# Altium project Homodyne_detector.PrjPcb
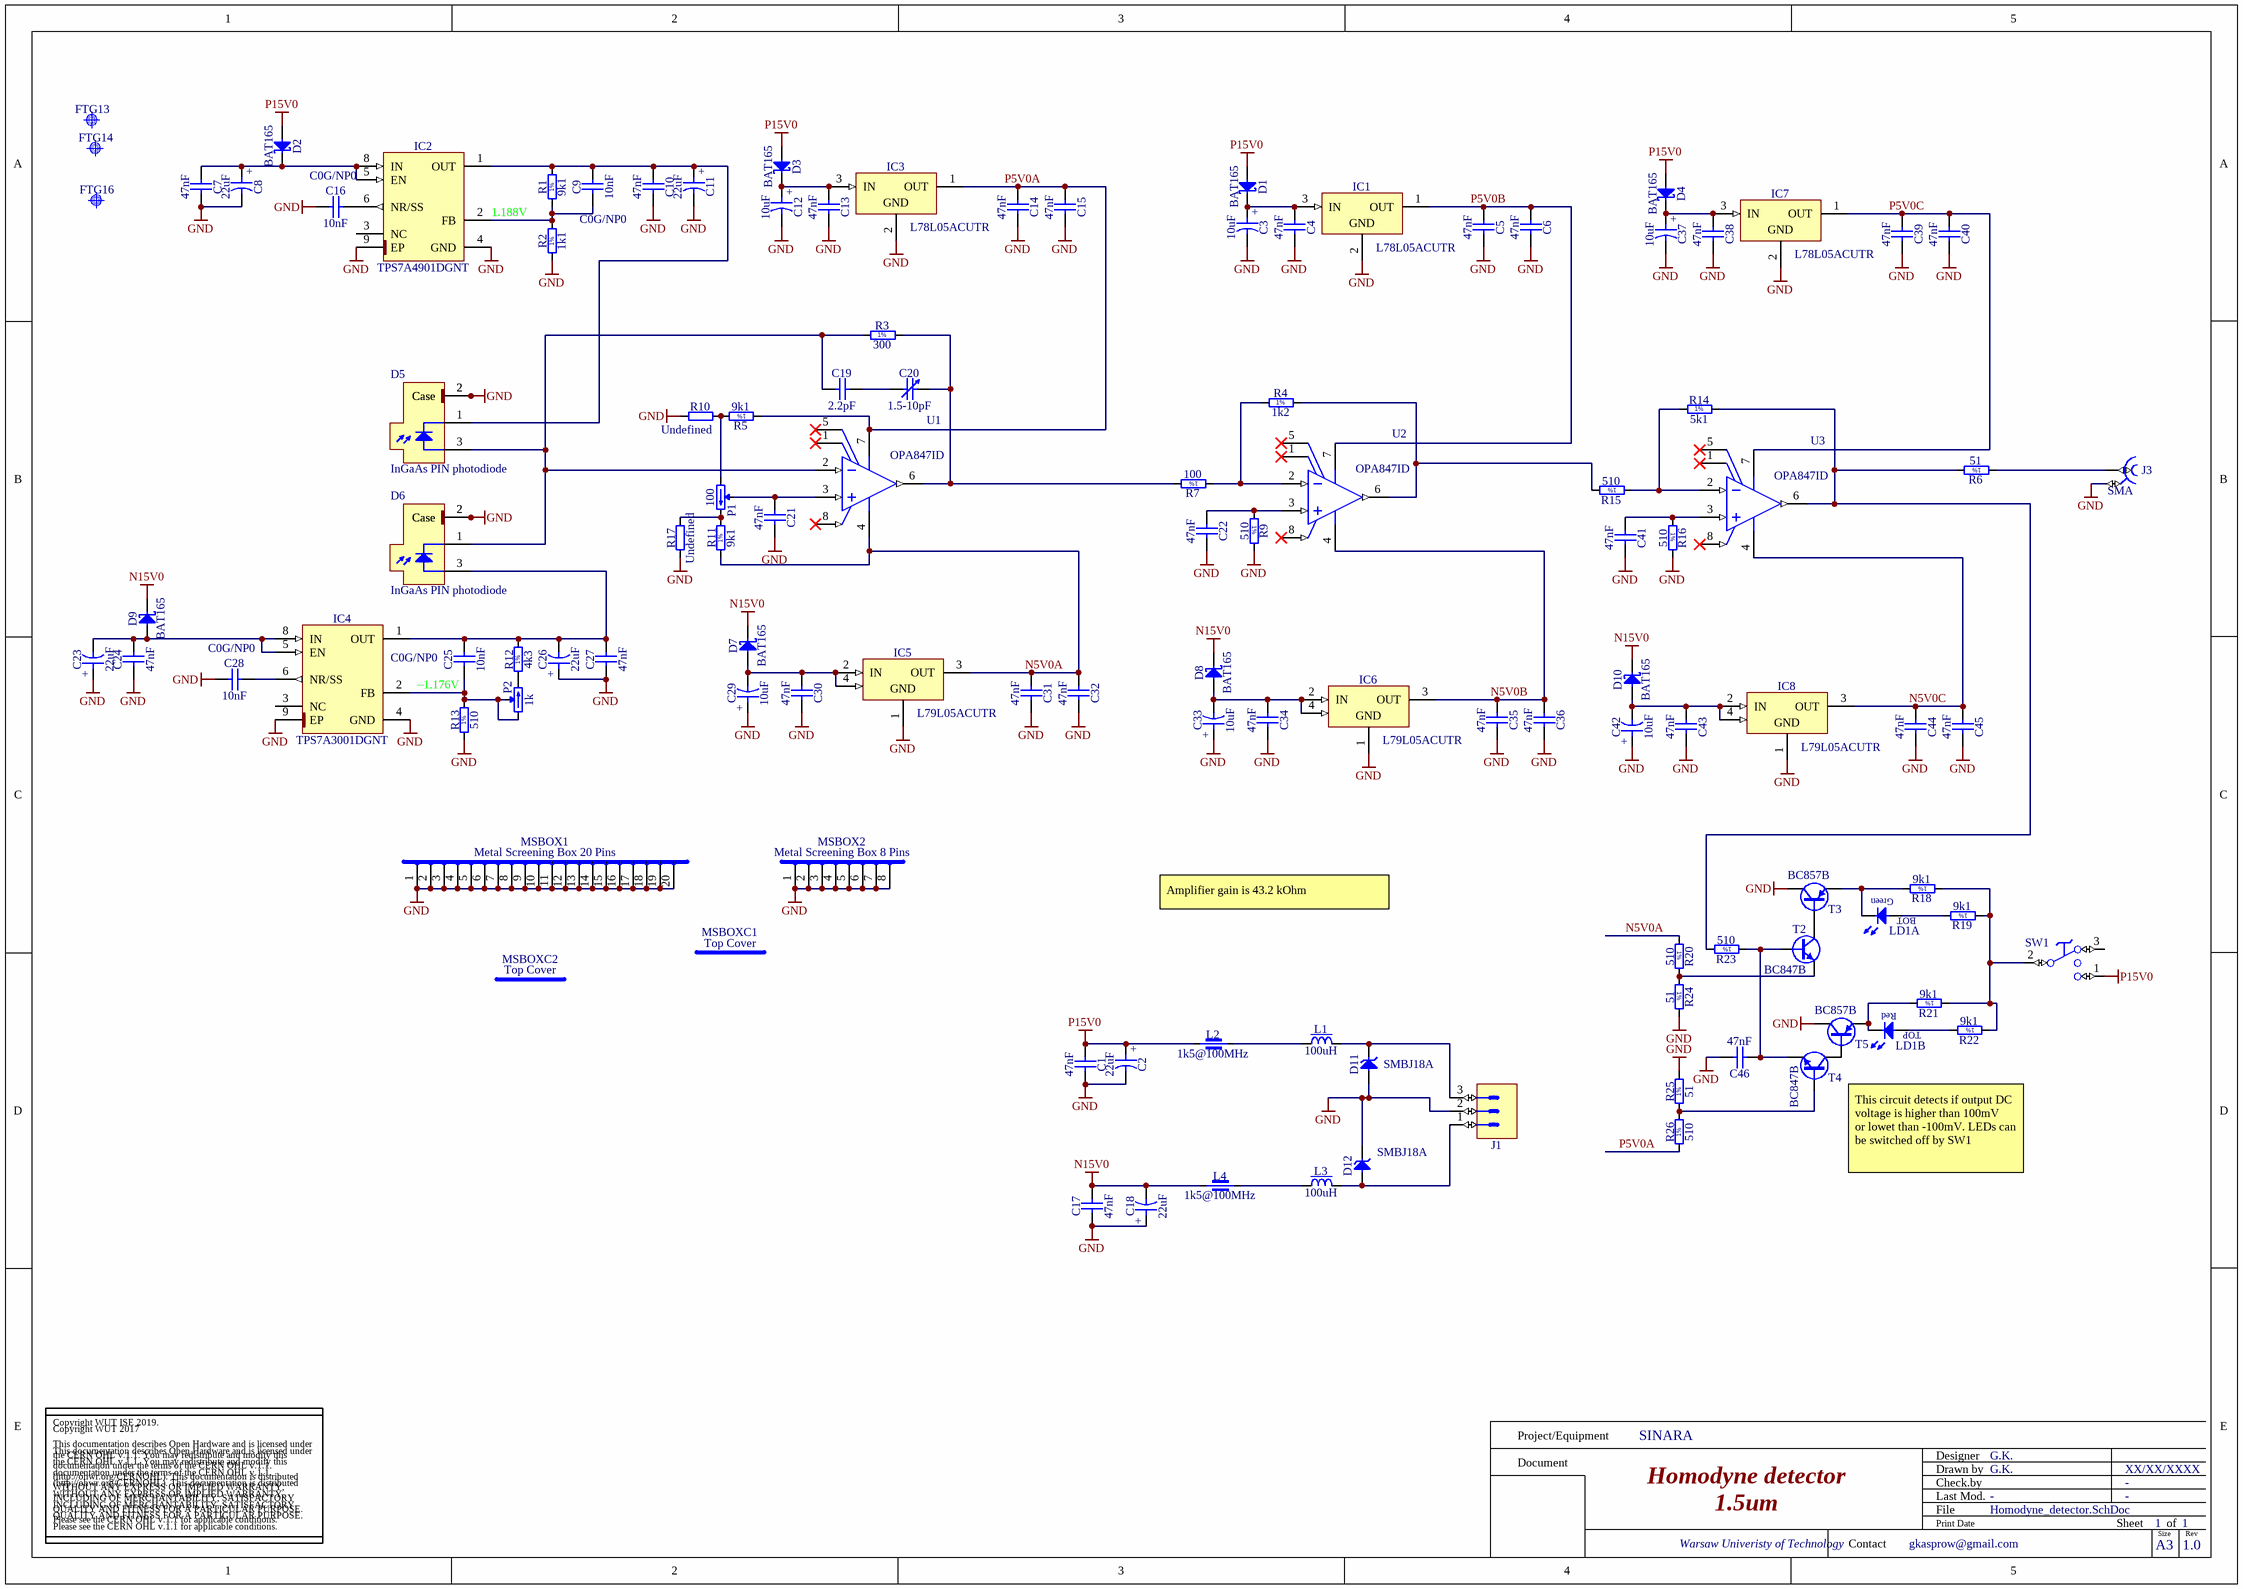
[diagram p0: Homodyne_detector.SchDoc]
1 sheet, 115 parts. Net scope: global (net labels, ports and power ports of the same name join across sheets).
Board file: Homodyne_detector.PcbDoc

## Sheet Homodyne_detector.SchDoc: Homodyne detector
size 420 x 297 mm; Author: G.K.; CompanyName: WUT; DrawnBy: G.K.; Organization: CERN; Address1: Warsaw Univeristy of Technology; Address2: Nowowiejska 15/19; Address3: gkasprow@gmail.com; Revision: 1.0; SheetNumber: 1; SheetTotal: 1; EDA_Number: ARTIQ; Projet: SINARA; ModifiedBy: -; CreateDate: XX/XX/XXXX; CheckedDate: -; Title2: 1.5um; DivGrp: ISE; Designer: G.K.; ModifiedDate: -; ProjectName: SINARA

### Parts
C1  47nF  [CAPC2012X135N]
C2  22uF  [CAPMP7343X190N]
C3  10uF  [CAPAE430X540N]
C4  47nF  [CAPC2012X135N]
C5  47nF  [CAPC2012X135N]
C6  47nF  [CAPC2012X135N]
C7  47nF  [CAPC2012X135N]
C8  22uF  [CAPMP7343X190N]
C9  10nF  TC: C0G/NP0  [CAPC2012X135N]
C10  47nF  [CAPC2012X135N]
C11  22uF  [CAPMP7343X190N]
C12  10uF  [CAPAE430X540N]
C13  47nF  [CAPC2012X135N]
C14  47nF  [CAPC2012X135N]
C15  47nF  [CAPC2012X135N]
C16  10nF  TC: C0G/NP0  [CAPC2012X135N]
C17  47nF  [CAPC2012X135N]
C18  22uF  [CAPMP7343X190N]
C19  2.2pF  [CAPC1608X87N]
C20  1.5-10pF  [CAPV_JOHANSON_9343]
C21  47nF  [CAPC2012X135N]
C22  47nF  [CAPC2012X135N]
C23  22uF  [CAPMP7343X190N]
C24  47nF  [CAPC2012X135N]
C25  10nF  TC: C0G/NP0  [CAPC2012X135N]
C26  22uF  [CAPMP7343X190N]
C27  47nF  [CAPC2012X135N]
C28  10nF  TC: C0G/NP0  [CAPC2012X135N]
C29  10uF  [CAPAE430X540N]
C30  47nF  [CAPC2012X135N]
C31  47nF  [CAPC2012X135N]
C32  47nF  [CAPC2012X135N]
C33  10uF  [CAPAE430X540N]
C34  47nF  [CAPC2012X135N]
C35  47nF  [CAPC2012X135N]
C36  47nF  [CAPC2012X135N]
C37  10uF  [CAPAE430X540N]
C38  47nF  [CAPC2012X135N]
C39  47nF  [CAPC2012X135N]
C40  47nF  [CAPC2012X135N]
C41  47nF  [CAPC2012X135N]
C42  10uF  [CAPAE430X540N]
C43  47nF  [CAPC2012X135N]
C44  47nF  [CAPC2012X135N]
C45  47nF  [CAPC2012X135N]
C46  47nF  [CAPC2012X135N]
D1  BAT165  [SOD2512X110N]
D2  BAT165  [SOD2512X110N]
D3  BAT165  [SOD2512X110N]
D4  BAT165  [SOD2512X110N]
D5  InGaAs PIN photodiode  [Hamamatsu_TO-18_H]
D6  InGaAs PIN photodiode  [Hamamatsu_TO-18_H]
D7  BAT165  [SOD2512X110N]
D8  BAT165  [SOD2512X110N]
D9  BAT165  [SOD2512X110N]
D10  BAT165  [SOD2512X110N]
D11  SMBJ18A  [DIOM5336X265N]
D12  SMBJ18A  [DIOM5336X265N]
FTG13  Use only in PCB  [FIDUCIAL_TOP_C100-200]  (value not drawn)
FTG14  Use only in PCB  [FIDUCIAL_TOP_S100-200]  (value not drawn)
FTG16  Use only in PCB  [FIDUCIAL_TOP_S100-200]  (value not drawn)
IC1  L78L05ACUTR  [SOT89]
IC2  TPS7A4901DGNT  [SOP65P490X110-9N-R157X189]
IC3  L78L05ACUTR  [SOT89]
IC4  TPS7A3001DGNT  [SOP65P490X110-9N-R157X189]
IC5  L79L05ACUTR  [SOT89]
IC6  L79L05ACUTR  [SOT89]
IC7  L78L05ACUTR  [SOT89]
IC8  L79L05ACUTR  [SOT89]
J1  (no value)  [PHOENIX_1757255]
J3  SMA  [RF249BT0050GHDW]
L1  100uH  [INDM5650X530N]
L2  1k5@100MHz  [INDC2012X110N]
L3  100uH  [INDM5650X530N]
L4  1k5@100MHz  [INDC2012X110N]
LD1  Red/Green  [LED_DIALIGHT_571-0112F]  (value not drawn)  (parts A,B of 2)
MSBOX1  Metal Screening Box 20 Pins  [MSBOX_LAIRD_BMI-S-205-F]
MSBOX2  Metal Screening Box 8 Pins  [MSBOX_LAIRD_BMI-S-202-F]
MSBOXC1  Top Cover  [MSBOX_LAIRD_BMI-S-202-C]
MSBOXC2  Top Cover  [MSBOX_LAIRD_BMI-S-205-C]
P1  100  [TRIM_BOURNS_3006P]
P2  1k  [TRIM_BOURNS_3314G-1]
R1  9k1  [RESC1608X55N]
R2  1k1  [RESC1608X55N]
R3  300  [RESC1608X55N]
R4  1k2  [RESC1608X55N]
R5  9k1  [RESC1608X55N]
R6  51  [RESC1608X55N]
R7  100  [RESC1608X55N]
R9  510  [RESC1608X55N]
R10  Undefined  [RESC1608X55N]
R11  9k1  [RESC1608X55N]
R12  4k3  [RESC1608X55N]
R13  510  [RESC1608X55N]
R14  5k1  [RESC1608X55N]
R15  510  [RESC1608X55N]
R16  510  [RESC1608X55N]
R17  Undefined  [RESC1608X55N]
R18  9k1  [RESC1608X55N]
R19  9k1  [RESC1608X55N]
R20  510  [RESC1608X55N]
R21  9k1  [RESC1608X55N]
R22  9k1  [RESC1608X55N]
R23  510  [RESC1608X55N]
R24  51  [RESC1608X55N]
R25  51  [RESC1608X55N]
R26  510  [RESC1608X55N]
SW1  Switch  [SW_NKK_A13AV]  (value not drawn)
T2  BC847B  [SOT95P230X110-3N]
T3  BC857B  [SOT95P230X110-3N]
T4  BC847B  [SOT95P230X110-3N]
T5  BC857B  [SOT95P230X110-3N]
U1  OPA847ID  [D0008A_L]
U2  OPA847ID  [D0008A_L]
U3  OPA847ID  [D0008A_L]

### Nets
GND: C1.2 C2.2 C3.2 C4.2 C5.2 C6.2 C7.2 C8.2 C10.2 C11.2 C12.2 C13.2 C14.2 C15.2 C16.1 C17.1 C18.1 C21.2 C22.2 C23.1 C24.1 C26.1 C27.1 C28.1 C29.1 C30.2 C31.2 C32.2 C33.1 C34.2 C35.2 C36.2 C37.2 C38.2 C39.2 C40.2 C41.2 C42.1 C43.2 C44.2 C45.2 C46.2 D5.2(Case) D6.2(Case) D11.2(A) D12.1(C) IC1.2(GND) IC2.4(GND) IC2.9(EP) IC3.2(GND) IC4.4(GND) IC4.9(EP) IC5.1(GND) IC6.1(GND) IC7.2(GND) IC8.1(GND) J1.2 J3.2 MSBOX1.1 MSBOX1.2 MSBOX1.3 MSBOX1.4 MSBOX1.5 MSBOX1.6 MSBOX1.7 MSBOX1.8 MSBOX1.9 MSBOX1.10 MSBOX1.11 MSBOX1.12 MSBOX1.13 MSBOX1.14 MSBOX1.15 MSBOX1.16 MSBOX1.17 MSBOX1.18 MSBOX1.19 MSBOX1.20 MSBOX2.1 MSBOX2.2 MSBOX2.3 MSBOX2.4 MSBOX2.5 MSBOX2.6 MSBOX2.7 MSBOX2.8 R2.1 R9.2 R10.1 R13.1 R16.2 R17.1 R24.2 R25.2 T3.3(C) T5.3(C)
N15V0: C17.2 C18.2 D7.1(C) D8.1(C) D9.1(C) D10.1(C) L4.1
P15V0: C1.1 C2.1 D1.2(A) D2.2(A) D3.2(A) D4.2(A) L2.1 SW1.1(NO)
N5V0A: C31.1 C32.1 IC5.3(OUT) R11.1 R20.1 U1.4(VS-)
N5V0B: C35.1 C36.1 IC6.3(OUT) U2.4(VS-)
N5V0C: C44.1 C45.1 IC8.3(OUT) U3.4(VS-)
P5V0A: C14.1 C15.1 IC3.1(OUT) R5.1 R26.1 U1.7(VS+)
P5V0B: C5.1 C6.1 IC1.1(OUT) U2.7(VS+)
P5V0C: C39.1 C40.1 IC7.1(OUT) U3.7(VS+)
NetC3_1: C3.1 C4.1 D1.1(C) IC1.3(IN)
NetC7_1: C7.1 C8.1 D2.1(C) IC2.5(EN) IC2.8(IN)
NetC9_1: C9.1 IC2.2(FB) R1.1 R2.2
NetC9_2: C9.2 C10.1 C11.1 D5.1(Cathode) IC2.1(OUT) R1.2
NetC12_1: C12.1 C13.1 D3.1(C) IC3.3(IN)
NetC16_2: C16.2 IC2.6(NR/SS)
NetC19_1: C19.1 D5.3(Anode) D6.1(Cathode) R3.1 U1.2(IN-)
NetC19_2: C19.2 C20.1
NetC20_2: C20.2 R3.2 R7.2 U1.6(OUT)
NetC21_1: C21.1 P1.2(W) U1.3(IN+)
NetC22_1: C22.1 R9.1 U2.3(IN+)
NetC23_2: C23.2 C24.2 D9.2(A) IC4.5(EN) IC4.8(IN)
NetC25_1: C25.1 IC4.2(FB) P2.1(CCW) P2.2(W) R13.2
NetC25_2: C25.2 C26.2 C27.2 D6.3(Anode) IC4.1(OUT) R12.2
NetC28_2: C28.2 IC4.6(NR/SS)
NetC29_2: C29.2 C30.1 D7.2(A) IC5.2(IN) IC5.4(IN)
NetC33_2: C33.2 C34.1 D8.2(A) IC6.2(IN) IC6.4(IN)
NetC37_1: C37.1 C38.1 D4.1(C) IC7.3(IN)
NetC41_1: C41.1 R16.1 U3.3(IN+)
NetC42_2: C42.2 C43.1 D10.2(A) IC8.2(IN) IC8.4(IN)
NetC46_1: C46.1 R23.1 T2.1(B) T4.2(E)
NetD11_1: D11.1(C) J1.3 L1.2
NetD12_2: D12.2(A) J1.1 L3.2
NetJ3_1: J3.1 R6.1
NetL1_1: L1.1 L2.2
NetL3_1: L3.1 L4.2
NetLD1_1: LD1.1(C) R18.2 T3.2(E)
NetLD1_2: LD1.2(A) R19.2
NetLD1_3: LD1.3(C) R21.2 T5.2(E)
NetLD1_4: LD1.4(A) R22.2
NetP1_1: P1.1(CCW) R5.2 R10.2
NetP1_3: P1.3(CW) R11.2 R17.2
NetP2_3: P2.3(CW) R12.1
NetR4_1: R4.1 R7.1 U2.2(IN-)
NetR4_2: R4.2 R15.2 U2.6(OUT)
NetR6_2: R6.2 R14.2 R23.2 U3.6(OUT)
NetR14_1: R14.1 R15.1 U3.2(IN-)
NetR18_1: R18.1 R19.1 R21.1 R22.1 SW1.2(C)
NetR20_2: R20.2 R24.1 T2.2(E)
NetR25_1: R25.1 R26.2 T4.1(B)
NetT2_3: T2.3(C) T3.1(B)
NetT4_3: T4.3(C) T5.1(B)

Not connected (* = marked no-connect by the designer): IC2 3(NC); IC4 3(NC); SW1 3(NC); U1 1(NC)* 5(NC)* 8(~{DIS})*; U2 1(NC)* 5(NC)* 8(~{DIS})*; U3 1(NC)* 5(NC)* 8(~{DIS})*

### Notes on the sheet
- 1.188V
- –1.176V
- Amplifier gain is 43.2 kOhm
- This circuit detects if output DC voltage is higher than 100mV
  or lowet than -100mV. LEDs can be switched off by SW1
- Copyright WUT 2017
  This documentation describes Open Hardware and is licensed under the CERN OHL v.1.1. You may redistribute and modify this documentation under the terms of the CERN OHL v.1.1. (http://ohwr.org/CERNOHL). This documentation is distributed WITHOUT ANY EXPRESS OR IMPLIED WARRANTY, INCLUDING OF MERCHANTABILITY, SATISFACTORY QUALITY AND FITNESS FOR A PARTICULAR PURPOSE. Please see the CERN OHL v.1.1 for applicable conditions.
- Project/Equipment
- Document
- Designer
- Drawn by
- Check.by
- Copyright WUT ISE 2019.
  This documentation describes Open Hardware and is licensed under the CERN OHL v.1.1. You may redistribute and modify this documentation under the terms of the CERN OHL v.1.1. (http://ohwr.org/CERNOHL). This documentation is distributed WITHOUT ANY EXPRESS OR IMPLIED WARRANTY, INCLUDING OF MERCHANTABILITY, SATISFACTORY QUALITY AND FITNESS FOR A PARTICULAR PURPOSE. Please see the CERN OHL v.1.1 for applicable conditions.
- Contact
- File
- Last Mod.
- Print Date
- Sheet
- Size
- A3
- of
- Rev
- (in symbol CAE430-540_10UF_25V_20%) +
- (in symbol CTE7343-19_22UF_20V_20%_LESR0045_KEMET_T520) +
- (in symbol LED_DIALIGHT_571-0112F, part A) Green; BOT
- (in symbol LED_DIALIGHT_571-0112F, part B) Red; TOP
- (in symbol R0603_1K1_1%_0.1W_100PPM) 1%
- (in symbol R0603_1k2_1%_0.1W_100PPM) 1%
- (in symbol R0603_4K3_1%_0.1W_100PPM) 1%
- (in symbol R0603_5K1_1%_0.1W_100PPM) 1%
- (in symbol R0603_9K1_1%_0.1W_100PPM) 1%
- (in symbol R0603_51R_1%_0.1W_100PPM) 1%
- (in symbol R0603_100R_1%_0.1W_100PPM) 1%
- (in symbol R0603_300R_1%_0.1W_100PPM) 1%
- (in symbol R0603_510R_1%_0.1W_100PPM) 1%

### Library data of the parts
C1 C4-C7 C10 C13-C15 C17 C21 C22 C24 C27 C30-C32 C34-C36 C38-C41 C43-C46 = CC0805_47NF_25V_5%_C0G: Non-polarised capacitor; Part Description: SMD Multilayer Chip Ceramic Capacitor; Manufacturer: GENERIC; Manufacturer1 Part Number: C0805C473J3GACTU; Voltage: 25V; TC: C0G/NP0; Tolerance: ±5%; Part Number: CC0805_47NF_25V_5%_C0G; Component Kind: Standard; Component Type: Standard; Pin Count: 2; Value: 47nF; Status: None; Manufacturer Part Number: CC0805_47NF_25V_5%_C0G; Case: 0805; Mounted: Yes; Socket: No; SMD: Yes; Sense: No; Manufacturer1 Example: KEMET; Manufacturer1 ComponentHeight: 1.4mm; HelpURL: \\cern.ch\dfs\Applications\Altium\Datasheets\CC0805_C0G_KEMET_(Commercial Grade).pdf; Author: CERN DEM JLC; CreateDate: 18.01.2011; LatestRevisionDate: 18.01.2011
C2 C8 C11 C18 C23 C26 = CTE7343-19_22UF_20V_20%_LESR0045_KEMET_T520: Polarised capacitor; Part Description: Low ESR 0R045 Tantalum Chip Capacitor; Manufacturer: KEMET; Manufacturer Part Number: T520V226M020ATE045; Voltage: 20V; Tolerance: ±20%; Part Number: CTE7343-19_22UF_20V_20%_LESR0045_KEMET_T520; Component Kind: Standard; Component Type: Standard; Pin Count: 2; Value: 22uF; Status: None; Case: V; Mounted: Yes; Socket: No; SMD: Yes; Sense: No; ComponentHeight: 1.9mm; HelpURL: \\cern.ch\dfs\Applications\Altium\Datasheets\CTE-LESR_KEMET_T520.pdf; Author: CERN DEM JLC; CreateDate: 05.02.2009; LatestRevisionDate: 23.03.2016
C3 C12 C29 C33 C37 C42 = CAE430-540_10UF_25V_20%: Polarised capacitor; Part Description: Aluminum Electrolytic SMT Capacitor; Manufacturer: PANASONIC; Manufacturer Part Number: EEEFK1E100AR; Voltage: 25V; Tolerance: ±20%; Part Number: CAE430-540_10UF_25V_20%; Component Kind: Standard; Component Type: Standard; Pin Count: 2; Value: 10uF; Status: Not Recommended; Case: B; Mounted: Yes; Socket: No; SMD: Yes; Sense: No; ComponentHeight: 5.8mm; HelpURL: \\cern.ch\dfs\Applications\Altium\Datasheets\CAE_PANASONIC_FK.pdf; Author: CERN DEM JLC; CreateDate: 03.12.2007; LatestRevisionDate: 05.11.2014
C9 C16 C25 C28 = CC0805_10NF_50V_5%_C0G: Non-polarised capacitor; Part Description: SMD Multilayer Chip Ceramic Capacitor; Manufacturer: GENERIC; Manufacturer1 Part Number: C0805C103J5GACTU; Voltage: 50V; Tolerance: ±5%; Part Number: CC0805_10NF_50V_5%_C0G; Component Kind: Standard; Component Type: Standard; Pin Count: 2; Value: 10nF; Status: None; Manufacturer Part Number: CC0805_10NF_50V_5%_C0G; Case: 0805; Mounted: Yes; Socket: No; SMD: Yes; Sense: No; Manufacturer1 Example: KEMET; Manufacturer1 ComponentHeight: 0.88mm; HelpURL: \\cern.ch\dfs\Applications\Altium\Datasheets\CC0805_C0G_KEMET_(Commercial Grade).pdf; Author: CERN DEM JLC; CreateDate: 02.02.2011; LatestRevisionDate: 22.04.2015
C19 = CC0603_2.2PF_50V_0.25PF_NP0: Non-polarised capacitor; Part Description: SMD Multilayer Chip Ceramic Capacitor; Manufacturer: GENERIC; Manufacturer1 Part Number: 223886715228; Voltage: 50V; TC: C0G/NP0; Tolerance: ±0.25pF; Part Number: CC0603_2.2PF_50V_0.25PF_NP0; Component Kind: Standard; Component Type: Standard; Pin Count: 2; Value: 2.2pF; Status: Preferred; Manufacturer Part Number: CC0603_2.2PF_50V_0.25PF_NP0; Case: 0603; Mounted: Yes; Socket: No; SMD: Yes; Sense: No; Manufacturer1 Example: PHYCOMP; Manufacturer1 ComponentHeight: 0.87mm; HelpURL: \\cern.ch\dfs\Applications\Altium\Datasheets\CC0603_NP0_PHYCOMP.pdf; Author: CERN DEM JLC; CreateDate: 03.12.2007; LatestRevisionDate: 03.12.2007
C20 = CADJ_1.5-10PF_50V_JOHANSON_9343-14R1: Adjustable Capacitor; Part Description: SMD Single Turn Ceramic Trimmer (Adjustable) Capacitor; Voltage: 50V; Part Number: CADJ_1.5-10PF_50V_JOHANSON_9343-14R1; Component Kind: Standard; Component Type: Standard; Pin Count: 2; Value: 1.5-10pF; Status: None; Manufacturer: JOHANSON; Manufacturer Part Number: 9343-14R1; Mounted: Yes; Socket: No; SMD: Yes; Sense: No; HelpURL: \\cern.ch\dfs\Applications\Altium\Datasheets\CADJ_JOHANSON_9343.pdf; Author: CERN DEM JLC; CreateDate: 14.01.2014; LatestRevisionDate: 14.01.2014
D1-D4 D7-D10 = BAT165: Schottky Diode; Part Description: Medium Power AF Schottky Diode; Manufacturer: INFINEON; Voltage: 40V; Power: 750mA; PressFit: No; Bonding: No; Part Number: BAT165; Component Kind: Standard; Component Type: Standard; Device: BAT165; PackageDescription: Small Outline Diode (SOD-323), 1.70mm W X 1.25mm L X 1.10mm H body,  IPC Medium Density; Manufacturer Part Number: BAT165; Pin Count: 2; Case: SOD323; Mounted: Yes; Socket: No; SMD: Yes; Sense: No; ComponentHeight: 1.1mm; HelpURL: \\cern.ch\dfs\Applications\Altium\Datasheets\BAT165.pdf; Author: CERN DEM JLC; CreateDate: 12.11.2014; LatestRevisionDate: 12.11.2014
D5 D6 = PhotoDiode_G12180-003A: High Speed InGaAs Photodiode, Optical Communications, Single/Multi-Mode Fiber Optic Receiver; Manufacturer: Hamamatsu; PressFit: No; Bonding: No; Part Number: G12180-003A; Component Kind: Standard; Component Type: Standard; Device: InGaAs PIN photodiode; Footprint: TO-18; PackageDescription: TO-18, 3 Leads with Micro Lense, 5.4 mm D X 3.75mm H; Part Description: InGaAs PIN photodiode; Manufacturer Part Number: G12180-003A; Pin Count: 3; Case: TO-18; Mounted: Yes; Socket: No; SMD: No; Sense: No; ComponentHeight: 3.75mm; HelpURL: \\cern.ch\dfs\Applications\Altium\Datasheets\FCI-InGaAs-120.pdf; Author: GK; CreateDate: 27.08.2019; LatestRevisionDate: 27.08.2019
D11 D12 = SMBJ18A: Zener Diode; Part Description: Uni-Directional Transient Voltage Suppressor Diode; Manufacturer: FAIRCHILD SEMICONDUCTOR; Voltage: 18V; Power: 600W; PressFit: No; Bonding: No; Part Number: SMBJ18A; Component Kind: Standard; Component Type: Standard; Device: SMBJ18A; PackageDescription: DO-214-AA/SMB Diode, Molded Body; 5.34mm L X 3.625mm W X 2.65mm H, IPC Medium Density; Manufacturer Part Number: SMBJ18A; Pin Count: 2; Case: DO-214AA; Mounted: Yes; Socket: No; SMD: Yes; Sense: No; ComponentHeight: 2.65mm; HelpURL: \\cern.ch\dfs\Applications\Altium\Datasheets\SMBJ.pdf; Author: CERN DEM JMW; CreateDate: 10.07.2015; LatestRevisionDate: 10.07.2015
FTG13 = FIDUCIAL_TARGET_C100-200: Fiducial Target; Part Description: Round Fiducial Target, Top Layer, 1.0mm, Top Solder 2.0mm, Keepout =2.0mm; Mounted: No; Part Number: FIDUCIAL_TARGET_C100-200; Component Kind: Standard (No BOM); Component Type: Standard (No BOM); Pin Count: 1; Family: Fiducial; Socket: No; SMD: Yes; Sense: No; Status: None; ComponentHeight: 0mm; HelpURL: Undefined; Author: CERN DEM JLC; CreateDate: 09.02.2010; LatestRevisionDate: 04.04.2012; PackageDescription: Round Fiducial Target, Top Layer, 1.0mm, Top Solder 2.0mm, Keepout =2.0mm
FTG14 FTG16 = FIDUCIAL_TARGET_S100-200: Fiducial Target; Part Description: Square Fiducial Target, Top Layer, 1.0mm, Top Solder 2.0mm, Keepout =2.0mm; Mounted: No; Part Number: FIDUCIAL_TARGET_S100-200; Component Kind: Standard (No BOM); Component Type: Standard (No BOM); Pin Count: 1; Family: Fiducial; Socket: No; SMD: Yes; Sense: No; Status: None; ComponentHeight: 0mm; HelpURL: Undefined; Author: CERN DEM JLC; CreateDate: 09.02.2010; LatestRevisionDate: 04.04.2012; PackageDescription: Square Fiducial Target, Top Layer, 1.0mm, Top Solder 2.0mm, Keepout =2.0mm
IC1 IC3 IC7 = L78L05ACUTR: 3-Terminal Regulator 1=OUT 2=GND 3=IN; Part Description: 5V 100mA Positive Voltage Regulator; Manufacturer: ST MICROELECTRONICS; PressFit: No; Bonding: No; Part Number: L78L05ACUTR; Component Kind: Standard; Component Type: Standard; Device: L78L05ACUTR; PackageDescription: SOT89-3, 3-Leads, Body 2.44x4.5mm; Manufacturer Part Number: L78L05ACUTR; Pin Count: 4; Case: SOT89; Mounted: Yes; Socket: No; SMD: Yes; Sense: No; ComponentHeight: 1.6mm; HelpURL: \\cern.ch\dfs\Applications\Altium\Datasheets\L78L05ACUTR.pdf; Author: CERN DEM JLC; CreateDate: 10.10.2011; LatestRevisionDate: 06.12.2011
IC2 = TPS7A4901DGNT: +36V, +150mA, Ultralow-Noise, Positive Linear Regulator; Manufacturer: TEXAS INSTRUMENTS; PressFit: No; Bonding: No; Part Number: TPS7A4901DGNT; Component Kind: Standard; Component Type: Standard; Device: TPS7A4901DGNT; PackageDescription: SOP,0.65mm,pitch; 8 pin,3.00mm W X 3.00mm L X 1.10mm H body (w/thermal tab 1.57 X 1.89 mm), IPC Medium Density; Part Description: +36V, +150mA, Ultralow-Noise, Positive Linear Regulator; Manufacturer Part Number: TPS7A4901DGNT; Pin Count: 9; Case: TSSOP8; Mounted: Yes; Socket: No; SMD: Yes; Sense: No; ComponentHeight: 1.1mm; HelpURL: \\cern.ch\dfs\Applications\Altium\Datasheets\TPS7A4901DGNT.pdf; Author: CERN DEM JLC; CreateDate: 08.03.2011; LatestRevisionDate: 08.03.2011
IC4 = TPS7A3001DGNT: -36V, -200mA, Ultralow-Noise, Negative Linear Regulator; Manufacturer: TEXAS INSTRUMENTS; PressFit: No; Bonding: No; Part Number: TPS7A3001DGNT; Component Kind: Standard; Component Type: Standard; Device: TPS7A3001DGNT; PackageDescription: SOP,0.65mm,pitch; 8 pin,3.00mm W X 3.00mm L X 1.10mm H body (w/thermal tab 1.57 X 1.89 mm), IPC Medium Density; Part Description: -36V, -200mA, Ultralow-Noise, Negative Linear Regulator; Manufacturer Part Number: TPS7A3001DGNT; Pin Count: 9; Case: TSSOP8; Mounted: Yes; Socket: No; SMD: Yes; Sense: No; ComponentHeight: 1.1mm; HelpURL: \\cern.ch\dfs\Applications\Altium\Datasheets\TPS7A3001DGNT.pdf; Author: CERN DEM JLC; CreateDate: 08.03.2011; LatestRevisionDate: 08.03.2011
IC5 IC6 IC8 = L79L05ACUTR: 3-Terminal Regulator 1=GND 2=IN 3=OUT 4=IN; Part Description: 5V 100mA Negative Voltage Regulator; Manufacturer: ST MICROELECTRONICS; PressFit: No; Bonding: No; Part Number: L79L05ACUTR; Component Kind: Standard; Component Type: Standard; Device: L79L05ACUTR; PackageDescription: SOT89-3, 3-Leads, Body 2.44x4.5mm; Manufacturer Part Number: L79L05ACUTR; Pin Count: 4; Case: SOT89; Mounted: Yes; Socket: No; SMD: Yes; Sense: No; ComponentHeight: 1.6mm; HelpURL: \\cern.ch\dfs\Applications\Altium\Datasheets\L79L05ACUTR.pdf; Author: CERN DEM JLC; CreateDate: 29.03.2012; LatestRevisionDate: 29.03.2012
J1 = PHOENIX_1757255: Connector 3 Male; Part Description: 12A, 250V, Pitch 5.08mm, 3 Positions Header; Manufacturer: PHOENIX CONTACT; Manufacturer Part Number: 1757255 (MSTBA 2,5/ 3-G-5,08); PressFit: No; Part Number: PHOENIX_1757255; Component Kind: Standard; Component Type: Standard; Pin Count: 3; Mounted: Yes; Socket: No; SMD: No; Sense: No; Status: None; ComponentHeight: 8.6mm; HelpURL: \\cern.ch\dfs\Applications\Altium\Datasheets\PHOENIX_1757255.pdf; Author: CERN DEM JLC; CreateDate: 10.02.2010; LatestRevisionDate: 26.04.2010
J3 = CON_SMA_RF249BT0050GHDW: 50 Ohm Through Hole SMA Right Angle PCB Jack; Part Number: AdamTech_RF249BT0050GHDW; Manufacturer: AdamTech; PressFit: No; Component Kind: Standard; Component Type: Standard; Pin Count: 5; Family: SMA; Mounted: Yes; Socket: No; SMD: No; Sense: No; Status: None; Part Description: 50 Ohm Through Hole SMA Right Angle PCB Jack; Manufacturer Part Number: RF249BT0050GHDW; ComponentHeight: 10.44mm; HelpURL: \\cern.ch\dfs\Applications\Altium\Datasheets\AMPHENOL_132203.pdf; Author: GK; CreateDate: 06.10.2016; LatestRevisionDate: 06.10.2016
L1 L3 = IND2220_100UH_10%_EPCOS_B82442H: Inductor With Core; Part Description: SMT Inductor SIMID Series; Manufacturer: EPCOS; Manufacturer Part Number: B82442H1104K000; Power: 350mA; Resistance: 1.28R; Tolerance: ±10%; Part Number: IND2220_100UH_10%_EPCOS_B82442H; Component Kind: Standard; Component Type: Standard; Pin Count: 2; Value: 100uH; Status: None; Case: 2220; Mounted: Yes; Socket: No; SMD: Yes; Sense: No; ComponentHeight: 5.3mm; HelpURL: \\cern.ch\dfs\Applications\Altium\Datasheets\IND2220_EPCOS_B82442H.pdf; Author: CERN DEM JLC; CreateDate: 03.10.2011; LatestRevisionDate: 03.10.2011
L2 L4 = IND0805_WURTH_742792097: Part Description: SMD EMI Suppression Chip Ferrite Bead (WE-CBF Series); Manufacturer: WURTH ELEKTRONIK; Power: 1A; Resistance: 0.3R; Tolerance: ±25%; Part Number: IND0805_WURTH_742792097; Component Kind: Standard; Component Type: Standard; Pin Count: 2; Value: 1k5@100MHz; Status: None; Manufacturer Part Number: 742792097; Case: 0805; Mounted: Yes; Socket: No; SMD: Yes; Sense: No; ComponentHeight: 1.1mm; HelpURL: \\cern.ch\dfs\Applications\Altium\Datasheets\IND0805_WURTH_742792097.pdf; Author: CERN DEM MR; CreateDate: 29.06.2017; LatestRevisionDate: 25.10.2018
LD1 = LED_DIALIGHT_571-0112F: 2x LED  Botom Green, Top Red; Part Description: Dual 2mm  LEDs, Red Top,Green Bot, CBI® Circuit Board Indicator (Without positioning pins); PressFit: No; Bonding: No; Part Number: LED_DIALIGHT_571-0112F; Component Kind: Standard; Component Type: Standard; Color: Red/Green; PackageDescription: 2x 2mm LED (Top: Red, Bot: Green) PCB Edge Mounting (Without positioning pins) DIALIGHT 571 Serie; Manufacturer: DIALIGHT; Manufacturer Part Number: 571-0112F; Pin Count: 4; Mounted: Yes; Socket: No; SMD: No; Sense: No; ComponentHeight: 8.6mm; HelpURL: \\cern.ch\dfs\Applications\Altium\Datasheets\LED_DIALIGHT_571-0112F.pdf; Author: CERN DEM JLC; CreateDate: 09.11.2009; LatestRevisionDate: 17.03.2010
MSBOX1 = MSBOX_LAIRD_BMI-S-205-F: Part Description: Frame of Standard Surface Mount Shield (Two Piece), External Dimensions 25.4 x 38.1mm; Manufacturer: LAIRD; PressFit: No; Part Number: MSBOX_LAIRD_BMI-S-205-F; Component Kind: Standard; Component Type: Standard; Pin Count: 20; PackageDescription: Frame of Standard Surface Mount Shield (Two Piece), External Dimensions 25.4 x 38.1mm; Mounted: Yes; Socket: No; SMD: Yes; Sense: No; Status: None; Manufacturer Part Number: BMI-S-205-F; ComponentHeight: 6mm; HelpURL: \\cern.ch\dfs\Applications\Altium\Datasheets\MSBOX_LAIRD_BMI-S-205-F.pdf; Author: CERN DEM JLC; CreateDate: 21.06.2017; LatestRevisionDate: 21.06.2017
MSBOX2 = MSBOX_LAIRD_BMI-S-202-F: Part Description: Frame of Standard Surface Mount Shield (Two Piece), External Dimensions 16.5 x 16.5mm; Manufacturer: LAIRD; PressFit: No; Part Number: MSBOX_LAIRD_BMI-S-202-F; Component Kind: Standard; Component Type: Standard; Pin Count: 8; PackageDescription: Frame of Standard Surface Mount Shield (Two Piece), External Dimensions 16.5 x 16.5mm; Mounted: Yes; Socket: No; SMD: Yes; Sense: No; Status: None; Manufacturer Part Number: BMI-S-202-F; ComponentHeight: 3.6mm; HelpURL: \\cern.ch\dfs\Applications\Altium\Datasheets\MSBOX_LAIRD_BMI-S-202-F.pdf; Author: CERN DEM JLC; CreateDate: 15.06.2017; LatestRevisionDate: 15.06.2017
MSBOXC1 = MSBOX_LAIRD_BMI-S-202-C: Metal Screening Box - Top Cover 0 Pin; Part Description: Cover for Frame of Standard Surface Mount Shield (Two Piece), External Dimensions 16.5 x 16.5mm; Manufacturer: LAIRD; PressFit: No; Part Number: MSBOX_LAIRD_BMI-S-202-C; Component Kind: Standard; Component Type: Standard; Pin Count: 0; PackageDescription: Cover for Frame of Standard Surface Mount Shield (Two Piece), External Dimensions 16.5 x 16.5mm; Mounted: Yes; Socket: No; SMD: Yes; Sense: No; Status: None; Manufacturer Part Number: BMI-S-202-C; ComponentHeight: 2mm; HelpURL: \\cern.ch\dfs\Applications\Altium\Datasheets\MSBOX_LAIRD_BMI-S-202-C.pdf; Author: CERN DEM JLC; CreateDate: 15.06.2017; LatestRevisionDate: 15.06.2017
MSBOXC2 = MSBOX_LAIRD_BMI-S-205-C: Metal Screening Box - Top Cover 0 Pin; Part Description: Cover for Frame of Standard Surface Mount Shield (Two Piece), External Dimensions 25.86 x 38.56mm; Manufacturer: LAIRD; PressFit: No; Part Number: MSBOX_LAIRD_BMI-S-205-C; Component Kind: Standard; Component Type: Standard; Pin Count: 0; PackageDescription: Cover for Frame of Standard Surface Mount Shield (Two Piece), External Dimensions 25.86 x 38.56mm; Mounted: Yes; Socket: No; SMD: Yes; Sense: No; Status: None; Manufacturer Part Number: BMI-S-205-C; ComponentHeight: 2mm; HelpURL: \\cern.ch\dfs\Applications\Altium\Datasheets\MSBOX_LAIRD_BMI-S-205-C.pdf; Author: CERN DEM JLC; CreateDate: 21.06.2017; LatestRevisionDate: 21.06.2017
P1 = TRIM_15T_100R_BOURNS_3006P-1-101LF: Trimming Potentiometer; Part Description: 15 Turn Trimming Potentiometer; Manufacturer: BOURNS; Power: 0.75W; TC: ±100ppm/°C; Tolerance: ±10%; PressFit: No; Part Number: TRIM_15T_100R_BOURNS_3006P-1-101LF; Component Kind: Standard; Component Type: Standard; Pin Count: 3; Value: 100; Manufacturer Part Number: 3006P-1-101LF; Case: 3006P; Mounted: Yes; Socket: No; SMD: No; Sense: No; ComponentHeight: 6.35mm; HelpURL: \\cern.ch\dfs\Applications\Altium\Datasheets\TRIM_BOURNS_3006P.pdf; Author: CERN DEM JLC; CreateDate: 09.05.2017; LatestRevisionDate: 09.05.2017
P2 = TRIM_1T_1K_BOURNS_3314G-1-102E: Trimming Potentiometer; Part Description: Single Turn 4mm Square Trimpot® Trimming Potentiometer (Top Adjust); Manufacturer: BOURNS; Power: 0.25W; TC: ±100ppm/°C; Tolerance: ±20%; PressFit: No; Part Number: TRIM_1T_1K_BOURNS_3314G-1-102E; Component Kind: Standard; Component Type: Standard; Pin Count: 3; Value: 1k; Manufacturer Part Number: 3314G-1-102E; Case: 3314G-1; Mounted: Yes; Socket: No; SMD: Yes; Sense: No; ComponentHeight: 2.55mm; HelpURL: \\cern.ch\dfs\Applications\Altium\Datasheets\TRIM_BOURNS_3314G-1.pdf; Author: CERN DEM JLC; CreateDate: 04.03.2014; LatestRevisionDate: 04.03.2014
R1 R5 R11 R18 R19 R21 R22 = R0603_9K1_1%_0.1W_100PPM: Resistor - 1%; Part Description: General Purpose Thick Film Chip Resistor; Manufacturer: GENERIC; Manufacturer1 Part Number: NRC06F9101TRF; Power: 0.1W; TC: ±100ppm/°C; PressFit: No; Part Number: R0603_9K1_1%_0.1W_100PPM; Component Kind: Standard; Component Type: Standard; Pin Count: 2; Value: 9k1; Status: Preferred; Tolerance: ±1%; Manufacturer Part Number: R0603_9K1_1%_0.1W_100PPM; Case: 0603; Mounted: Yes; Sense: No; Socket: No; SMD: Yes; Manufacturer1 Example: NIC COMPONENT; Manufacturer1 ComponentHeight: 0.55mm; HelpURL: \\cern.ch\dfs\Applications\Altium\Datasheets\R0603_NIC_NRC.pdf; Author: CERN DEM JLC; CreateDate: 03.12.2007; LatestRevisionDate: 13.03.2008
R2 = R0603_1K1_1%_0.1W_100PPM: Resistor - 1%; Part Description: General Purpose Thick Film Chip Resistor; Manufacturer: GENERIC; Manufacturer1 Part Number: NRC06F1101TRF; Power: 0.1W; TC: ±100ppm/°C; PressFit: No; Part Number: R0603_1K1_1%_0.1W_100PPM; Component Kind: Standard; Component Type: Standard; Pin Count: 2; Value: 1k1; Status: Preferred; Tolerance: ±1%; Manufacturer Part Number: R0603_1K1_1%_0.1W_100PPM; Case: 0603; Mounted: Yes; Sense: No; Socket: No; SMD: Yes; Manufacturer1 Example: NIC COMPONENT; Manufacturer1 ComponentHeight: 0.55mm; HelpURL: \\cern.ch\dfs\Applications\Altium\Datasheets\R0603_NIC_NRC.pdf; Author: CERN DEM JLC; CreateDate: 03.12.2007; LatestRevisionDate: 13.03.2008
R3 = R0603_300R_1%_0.1W_100PPM: Resistor - 1%; Part Description: General Purpose Thick Film Chip Resistor; Manufacturer: GENERIC; Manufacturer1 Part Number: NRC06F3000TRF; Power: 0.1W; TC: ±100ppm/°C; PressFit: No; Part Number: R0603_300R_1%_0.1W_100PPM; Component Kind: Standard; Component Type: Standard; Pin Count: 2; Value: 300; Status: Preferred; Tolerance: ±1%; Manufacturer Part Number: R0603_300R_1%_0.1W_100PPM; Case: 0603; Mounted: Yes; Sense: No; Socket: No; SMD: Yes; Manufacturer1 Example: NIC COMPONENT; Manufacturer1 ComponentHeight: 0.55mm; HelpURL: \\cern.ch\dfs\Applications\Altium\Datasheets\R0603_NIC_NRC.pdf; Author: CERN DEM JLC; CreateDate: 03.12.2007; LatestRevisionDate: 13.03.2008
R4 = R0603_1k2_1%_0.1W_100PPM: Resistor - 1%; Part Description: General Purpose Thick Film Chip Resistor; Manufacturer: GENERIC; Manufacturer1 Part Number: NRC06F1201TRF; Power: 0.1W; TC: ±100ppm/°C; PressFit: No; Part Number: R0603_1K2_1%_0.1W_100PPM; Component Kind: Standard; Component Type: Standard; Pin Count: 2; Value: 1k2; Status: Preferred; Tolerance: ±1%; Manufacturer Part Number: R0603_1K2_1%_0.1W_100PPM; Case: 0603; Mounted: Yes; Sense: No; Socket: No; SMD: Yes; Manufacturer1 Example: NIC COMPONENT; Manufacturer1 ComponentHeight: 0.55mm; HelpURL: \\cern.ch\dfs\Applications\Altium\Datasheets\R0603_NIC_NRC.pdf; Author: CERN DEM JLC; CreateDate: 03.12.2007; LatestRevisionDate: 13.03.2008
R6 R24 R25 = R0603_51R_1%_0.1W_100PPM: Resistor - 1%; Part Description: General Purpose Thick Film Chip Resistor; Manufacturer: GENERIC; Manufacturer1 Part Number: NRC06F51R0TRF; Power: 0.1W; TC: ±100ppm/°C; PressFit: No; Part Number: R0603_51R_1%_0.1W_100PPM; Component Kind: Standard; Component Type: Standard; Pin Count: 2; Value: 51; Status: Preferred; Tolerance: ±1%; Manufacturer Part Number: R0603_51R_1%_0.1W_100PPM; Case: 0603; Mounted: Yes; Sense: No; Socket: No; SMD: Yes; Manufacturer1 Example: NIC COMPONENT; Manufacturer1 ComponentHeight: 0.55mm; HelpURL: \\cern.ch\dfs\Applications\Altium\Datasheets\R0603_NIC_NRC.pdf; Author: CERN DEM JLC; CreateDate: 03.12.2007; LatestRevisionDate: 13.03.2008
R7 = R0603_100R_1%_0.1W_100PPM: Resistor - 1%; Part Description: General Purpose Thick Film Chip Resistor; Manufacturer: GENERIC; Manufacturer1 Part Number: NRC06F4700TRF; Power: 0.1W; TC: ±100ppm/°C; PressFit: No; Part Number: R0603_100R_1%_0.1W_100PPM; Component Kind: Standard; Component Type: Standard; Pin Count: 2; Value: 100; Status: Preferred; Tolerance: ±1%; Manufacturer Part Number: R0603_100R_1%_0.1W_100PPM; Case: 0603; Mounted: Yes; Sense: No; Socket: No; SMD: Yes; Manufacturer1 Example: NIC COMPONENT; Manufacturer1 ComponentHeight: 0.55mm; HelpURL: \\cern.ch\dfs\Applications\Altium\Datasheets\R0603_NIC_NRC.pdf; Author: CERN DEM JLC; CreateDate: 03.12.2007; LatestRevisionDate: 13.03.2008
R9 R13 R15 R16 R20 R23 R26 = R0603_510R_1%_0.1W_100PPM: Resistor - 1%; Part Description: General Purpose Thick Film Chip Resistor; Manufacturer: GENERIC; Manufacturer1 Part Number: CRCW0603510RFKEA; Power: 0.1W; TC: ±100ppm/°C; PressFit: No; Part Number: R0603_510R_1%_0.1W_100PPM; Component Kind: Standard; Component Type: Standard; Pin Count: 2; Value: 510; Status: Preferred; Tolerance: ±1%; Manufacturer Part Number: R0603_510R_1%_0.1W_100PPM; Case: 0603; Mounted: Yes; Sense: No; Socket: No; SMD: Yes; Manufacturer1 Example: VISHAY; Manufacturer1 ComponentHeight: 0.5mm; HelpURL: \\cern.ch\dfs\Applications\Altium\Datasheets\R0603_VISHAY_CRCW e3.pdf; Author: CERN DEM JLC; CreateDate: 03.12.2007; LatestRevisionDate: 21.03.2018
R10 R17 = R0603_NO-VALUE: Resistor; Part Description: Reserved Footprint For a 0603 (1608) Chip Resistor; PressFit: No; Mounted: No; Part Number: R0603_NO-VALUE; Component Kind: Standard; Component Type: Standard; Pin Count: 2; Value: Undefined; Status: None; Manufacturer: Undefined; Manufacturer Part Number: R0603_NO-VALUE; Case: 0603; Sense: No; Socket: No; SMD: Yes; Manufacturer1 Example: Undefined; Manufacturer1 Part Number: Undefined; Manufacturer1 ComponentHeight: Undefined; HelpURL: Undefined; Author: CERN DEM JLC; CreateDate: 03.12.2007; LatestRevisionDate: 13.03.2008
R12 = R0603_4K3_1%_0.1W_100PPM: Resistor - 1%; Part Description: General Purpose Thick Film Chip Resistor; Manufacturer: GENERIC; Manufacturer1 Part Number: NRC06F4301TRF; Power: 0.1W; TC: ±100ppm/°C; PressFit: No; Part Number: R0603_4K3_1%_0.1W_100PPM; Component Kind: Standard; Component Type: Standard; Pin Count: 2; Value: 4k3; Status: Preferred; Tolerance: ±1%; Manufacturer Part Number: R0603_4K3_1%_0.1W_100PPM; Case: 0603; Mounted: Yes; Sense: No; Socket: No; SMD: Yes; Manufacturer1 Example: NIC COMPONENT; Manufacturer1 ComponentHeight: 0.55mm; HelpURL: \\cern.ch\dfs\Applications\Altium\Datasheets\R0603_NIC_NRC.pdf; Author: CERN DEM JLC; CreateDate: 03.12.2007; LatestRevisionDate: 13.03.2008
R14 = R0603_5K1_1%_0.1W_100PPM: Resistor - 1%; Part Description: General Purpose Thick Film Chip Resistor; Manufacturer: GENERIC; Manufacturer1 Part Number: NRC06F5101TRF; Power: 0.1W; TC: ±100ppm/°C; PressFit: No; Part Number: R0603_5K1_1%_0.1W_100PPM; Component Kind: Standard; Component Type: Standard; Pin Count: 2; Value: 5k1; Status: Preferred; Tolerance: ±1%; Manufacturer Part Number: R0603_5K1_1%_0.1W_100PPM; Case: 0603; Mounted: Yes; Sense: No; Socket: No; SMD: Yes; Manufacturer1 Example: NIC COMPONENT; Manufacturer1 ComponentHeight: 0.55mm; HelpURL: \\cern.ch\dfs\Applications\Altium\Datasheets\R0603_NIC_NRC.pdf; Author: CERN DEM JLC; CreateDate: 03.12.2007; LatestRevisionDate: 13.03.2008
SW1 = SW_NKK_A13AV: SPDT Switch; Part Description: Vertical Right Angle PCB Mounting, SPDT ON-OFF-ON Switch, Cotnact Rating 400mA 28V, NKK A Series; Manufacturer: NKK SWITCHES; Manufacturer Part Number: A13AV; PressFit: No; Part Number: SW_NKK_A13AV; Component Kind: Standard; Component Type: Standard; Pin Count: 5; PackageDescription: Body 5x10.2mm, Vertical Right Angle PCB Mounting, SPDT ON-OFF-ON Switch, NKK A Series; Family: Switch; Mounted: Yes; Socket: No; SMD: No; Sense: No; Status: None; ComponentHeight: 10.2mm; HelpURL: \\cern.ch\dfs\Applications\Altium\Datasheets\SW_NKK_A13AV.pdf; Author: CERN DEM MR; CreateDate: 20.02.2018; LatestRevisionDate: 20.02.2018
T2 T4 = BC847B: NPN Transistor; Part Description: 45V 100mA NPN general-purpose transistors; Manufacturer: NXP SEMICONDUCTORS; PressFit: No; Bonding: No; Part Number: BC847B; Component Kind: Standard; Component Type: Standard; Device: BC847B; PackageDescription: SOT23, 3 pin, Pitch 0.95mm - 1.3mm W X 2.9mm L X 1.1mm H, IPC Medium Density; Manufacturer Part Number: BC847B; Pin Count: 3; Case: SOT23-3; Mounted: Yes; Socket: No; SMD: Yes; Sense: No; ComponentHeight: 1.1mm; HelpURL: \\cern.ch\dfs\Applications\Altium\Datasheets\BC847B.pdf; Author: CERN DEM JLC; CreateDate: 14.06.2011; LatestRevisionDate: 14.06.2011
T3 T5 = BC857B: PNP Transistor; Part Description: 45V 100mA PNP general-purpose transistors; Manufacturer: NXP SEMICONDUCTORS; PressFit: No; Bonding: No; Part Number: BC857B; Component Kind: Standard; Component Type: Standard; Device: BC857B; PackageDescription: SOT23, 3 pin, Pitch 0.95mm - 1.3mm W X 2.9mm L X 1.1mm H, IPC Medium Density; Manufacturer Part Number: BC857B; Pin Count: 3; Case: SOT23-3; Mounted: Yes; Socket: No; SMD: Yes; Sense: No; ComponentHeight: 1.1mm; HelpURL: \\cern.ch\dfs\Applications\Altium\Datasheets\BC857B.pdf; Author: CERN DEM JLC; CreateDate: 14.06.2011; LatestRevisionDate: 14.06.2011
U1-U3 = CMP-0018-00371-2: Wideband, Ultra-Low Noise, Voltage Feedback Operational Amplifier with Shutdown, 10 to 12 V, -40 to 85 degC, 8-pin SOIC (D8), Green (RoHS & no Sb/Br); Manufacturer: Texas Instruments; Settling Time (0.1%)(Typ)(ns): 20; 2nd Harmonic(dBc): 105; Sub Family: High Output Current Amplifier (>=50mA), High Speed Amplifier (>=50MHz), Low Offset Voltage Amplifier (<=500uV); Iq per channel(Max)(mA): 18.9; Slew Rate(Typ)(V/us): 950; Iib(Max)(nA): 42000; Vs(Min)(V): 10; Vn at Flatband(Typ)(nV/rtHz): 0.85; Vio(Max)(mV): 0.5; Io(Typ)(mA): 75; Acl, min stable gain(V/V): 12; Number of Channels: 1; BW @ Acl(MHz): 600; THD (Fc is 1 MHz)(Typ)(dB): -96; 3rd Harmonic(dBc): 110; @ MHz: 5; PackageReference: D0008A; ComponentLink2URL: http://www.ti.com/general/docs/lit/getliterature.tsp?genericPartNumber=OPA847&fileType=pdf; Code_JEDEC: MS-012; Eco-Plan: Green (RoHS & no Sb/Br); ComponentLink3URL: http://www.ti.com/litv/pdf/msoi002j; ComponentLink3Description: Package Specification; PackageDescription: 8-Pin Plastic Small Outline, Body 4.9 x 3.9 mm, Pitch 1.27 mm; ComponentLink1Description: Manufacturer URL; Mounting Technology: Surface Mount; ComponentLink1URL: http://www.ti.com/; Vs(Max)(V): 12; ComponentLink2Description: Datasheet; PackageVersion: 4040047-3/M, 06/2011; DatasheetVersion: SBOS251E; PartNumber: OPA847ID

## Assembly variants
Straight: not fitted J15